# Altium project balancing_robot_board.PrjPCB
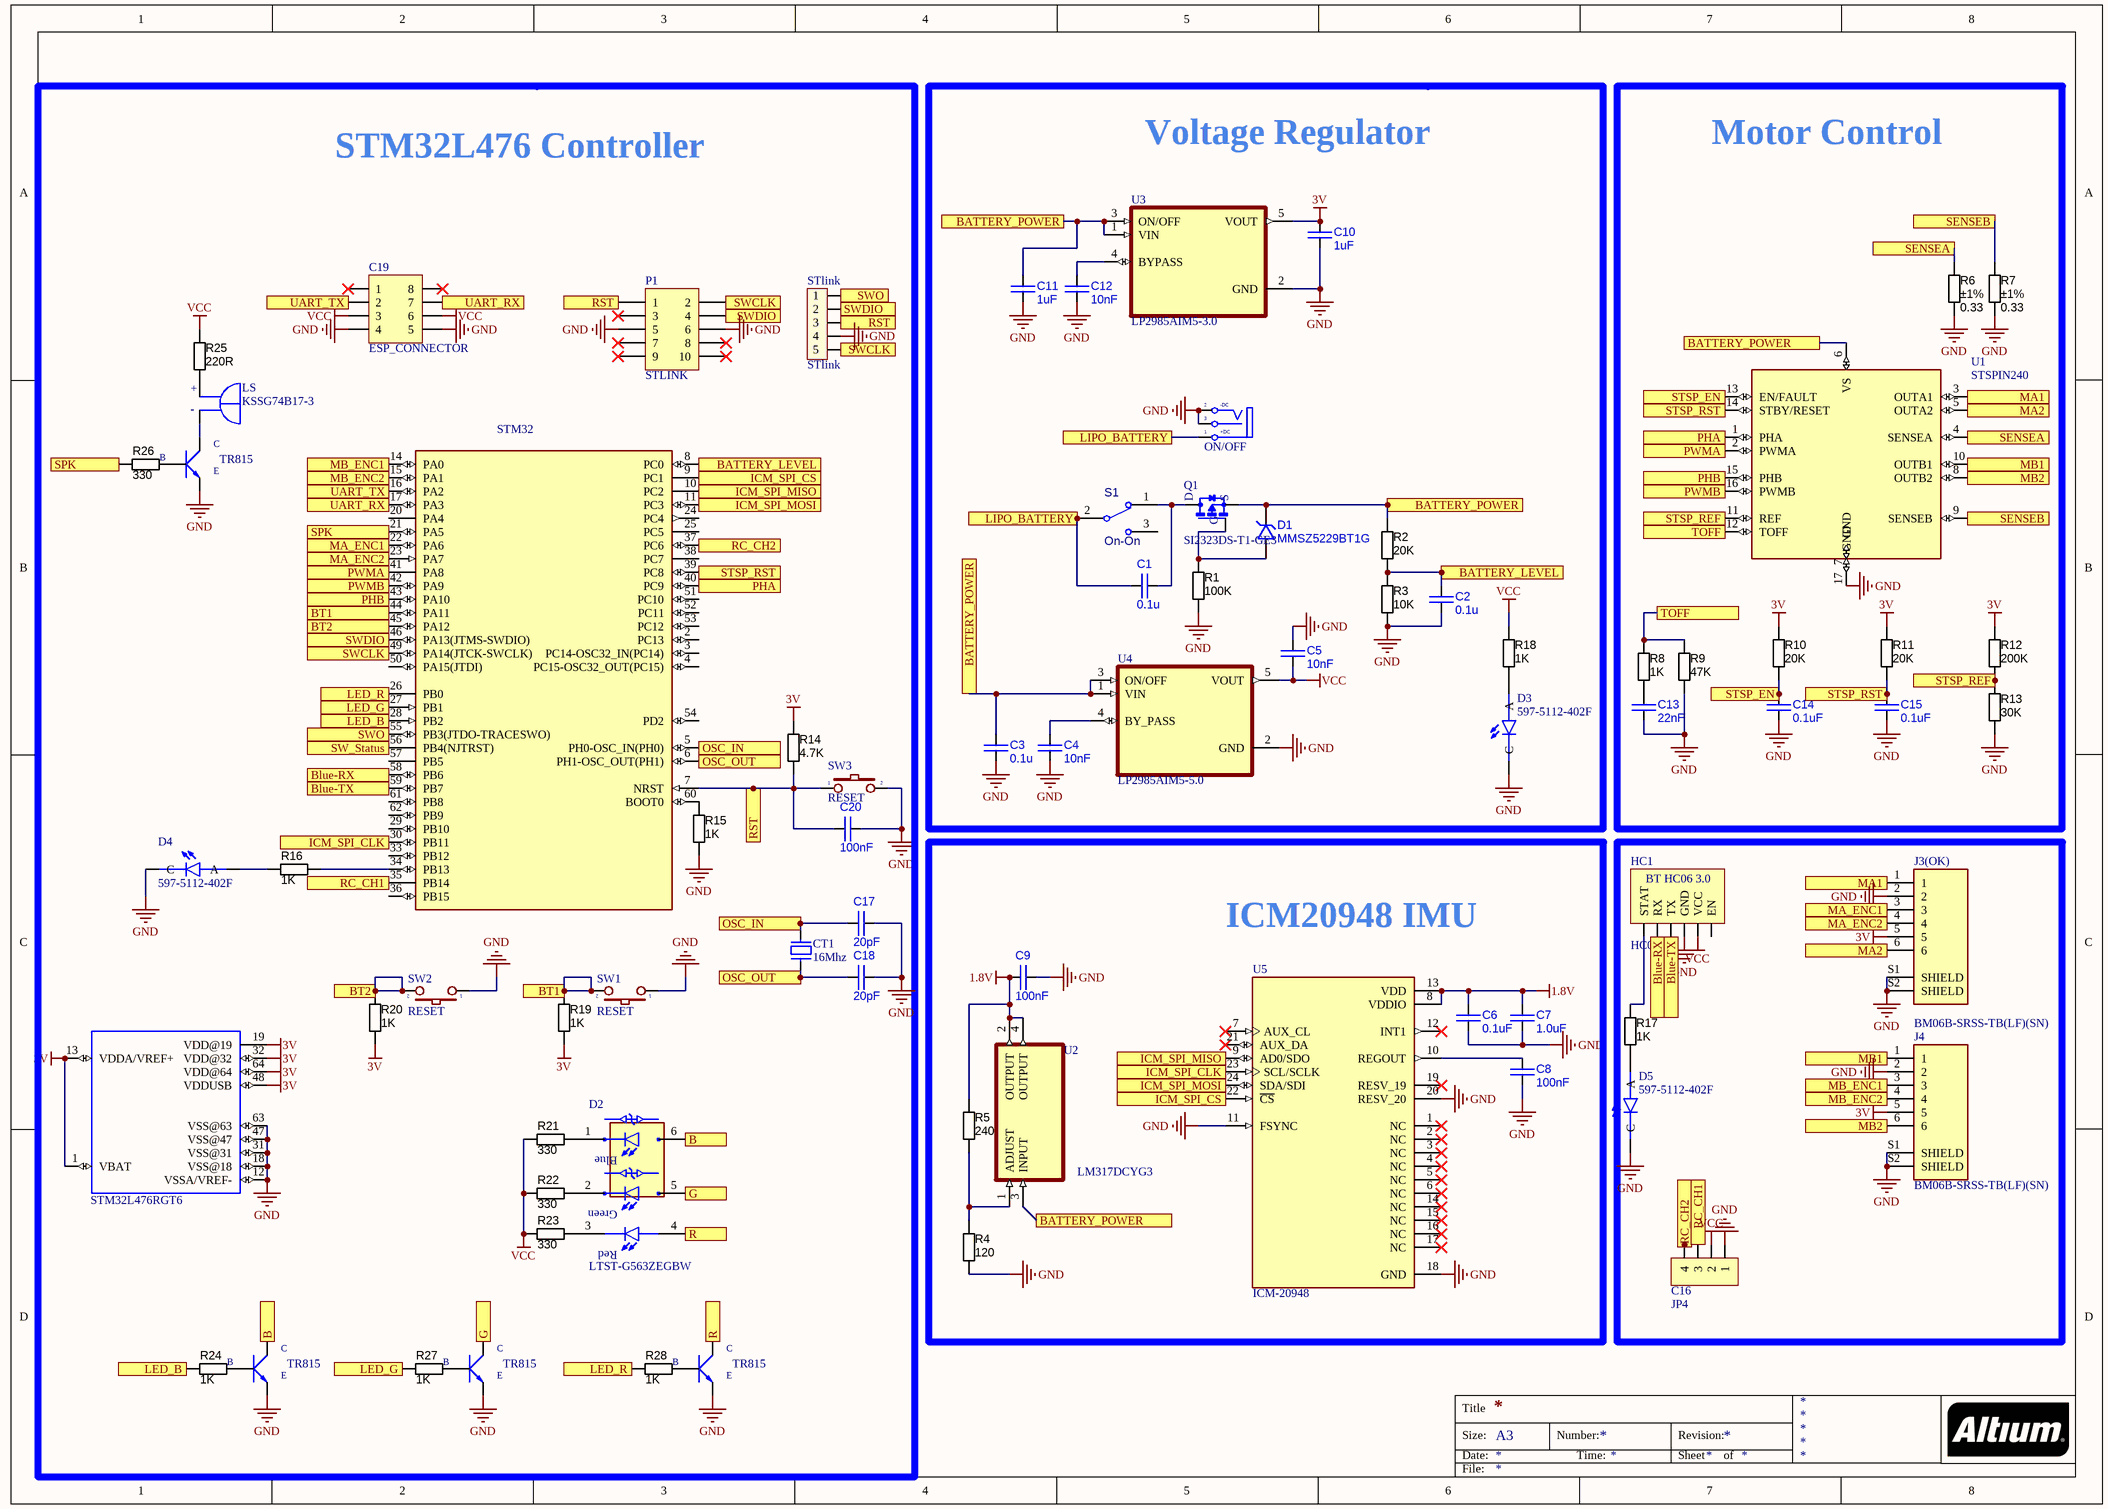
[diagram p0: balancing_robot_board.SchDoc]
1 sheet, 76 parts. Net scope: flat (ports and power ports of the same name join across sheets).
Board file: balancing_robot_board.PcbDoc

## Sheet balancing_robot_board.SchDoc
size A3

### Parts
C1  0.1u  [CAPC1005X55N]
C2  0.1u  [CAPC1005X55N]
C3  0.1u  [CAPC1005X55N]
C4  10nF  [CAPC1005X55N]
C5  10nF  [CAPC1005X55N]
C6  0.1uF  [CAPC1005X55N]
C7  1.0uF  [CAPC1005X55N]
C8  100nF  [CAPC1005X55N]
C9  100nF  [CAPC1005X55N]
C10  1uF  [CAPC1005X55N]
C11  1uF  [CAPC1005X55N]
C12  10nF  [CAPC1005X55N]
C13  22nF  [CAPC1005X55N]
C14  0.1uF  [CAPC1005X55N]
C15  0.1uF  [CAPC1005X55N]
C16  JP4  [JP4-C1T]
C17  20pF  [CAPC1005X55N]
C18  20pF  [CAPC1005X55N]
C19  ESP_CONNECTOR  [JP4-C2T]
C20  100nF  [CAPC1005X55N]
CT1  16Mhz  [CRYSTAL-SMD5032]
D1  MMSZ5229BT1G  [SOD123]
D2  LTST-G563ZEGBW  [LED_LTST-G563ZEGBW]
D3  597-5112-402F  [LEDSC160X80X70L45N]
D4  597-5112-402F  [LEDSC160X80X70L45N]
D5  597-5112-402F  [LEDSC160X80X70L45N]
HC1  HC06  [HC06]
J3(OK)  BM06B-SRSS-TB(LF)(SN)  [JST_BM06B-SRSS-TB(LF)(SN)]
J4  BM06B-SRSS-TB(LF)(SN)  [JST_BM06B-SRSS-TB(LF)(SN)]
LS  KSSG74B17-3  [XDCR_KSSG74B17-3]
ON/OFF  POWER  [PJ-031D]  (value not drawn)
P1  STLINK  [CABLE 10]
Q1  SI2323DS-T1-GE3  [SOT23]
R1  value 100K  [RESC1005X40N]  (hidden comment: Thick Film)
R2  value 20K  [RESC1005X40N]  (hidden comment: Thick Film)
R3  value 10K  [RESC1005X40N]  (hidden comment: Thick Film)
R4  value 120  [RESC1005X40N]  (hidden comment: Thick Film)
R5  value 240  [RESC1005X40N]  (hidden comment: Thick Film)
R6  value 0.33  Tolerance: ±1%  [RESC5025X70N]  (hidden comment: Thick Film)
R7  value 0.33  Tolerance: ±1%  [RESC5025X70N]  (hidden comment: Thick Film)
R8  value 1K  [RESC1005X40N]  (hidden comment: Thick Film)
R9  value 47K  [RESC1005X40N]  (hidden comment: Thick Film)
R10  value 20K  [RESC1005X40N]  (hidden comment: Thick Film)
R11  value 20K  [RESC1005X40N]  (hidden comment: Thick Film)
R12  value 200K  [RESC1005X40N]  (hidden comment: Thick Film)
R13  value 30K  [RESC1005X40N]  (hidden comment: Thick Film)
R14  value 4.7K  [RESC1005X40N]  (hidden comment: Thick Film)
R15  value 1K  [RESC1005X40N]  (hidden comment: Thick Film)
R16  value 1K  [RESC1005X40N]  (hidden comment: Thick Film)
R17  value 1K  [RESC1005X40N]  (hidden comment: Thick Film)
R18  value 1K  [RESC1005X40N]  (hidden comment: Thick Film)
R19  value 1K  [RESC1005X40N]  (hidden comment: Thick Film)
R20  value 1K  [RESC1005X40N]  (hidden comment: Thick Film)
R21  value 330  [RESC1005X40N]  (hidden comment: Thick Film)
R22  value 330  [RESC1005X40N]  (hidden comment: Thick Film)
R23  value 330  [RESC1005X40N]  (hidden comment: Thick Film)
R24  value 1K  [RESC1005X40N]  (hidden comment: Thick Film)
R25  value 220R  [RESC2012N_ZERO]  (hidden comment: Jumper)
R26  value 330  [RESC1005X40N]  (hidden comment: Thick Film)
R27  value 1K  [RESC1005X40N]  (hidden comment: Thick Film)
R28  value 1K  [RESC1005X40N]  (hidden comment: Thick Film)
S1  ON-ON  [Switch]
STA.TR1  TR815  [SOT-23B_L]
STA.TR2  TR815  [SOT-23B_L]
STA.TR3  TR815  [SOT-23B_L]
STA.TR4  TR815  [SOT-23B_L]
STlink  STlink  [JP5]
STM32  STM32L476RGT6  [LQFP-64(10X10)MM]
SW1  RESET  [SW1-SMD]
SW2  RESET  [SW1-SMD]
SW3  RESET  [SW1-SMD]
U1  STSPIN240  [VFQFPN_3X3X1MM]
U2  LM317DCYG3  [SOT230P700X180-4N]
U3  LP2985AIM5-3.0  [SOT95P280X145-5N]
U4  LP2985AIM5-5.0  [SOT95P280X145-5N]
U5  ICM-20948  [QFN40P300X300X105-24N]

### Blocks framed on the sheet
STM32L476 Controller: C17-C20 CT1 D2 D4 LS P1 R14-R16 R19-R28 STA.TR1-STA.TR4 STlink STM32 SW1-SW3
Voltage Regulator: C1-C5 C10-C12 D1 D3 ON/OFF Q1 R1-R3 R18 S1 U3 U4
Motor Control: C13-C15 R6-R13 U1
ICM20948 IMU: C6-C9 R4 R5 U2 U5

### Ports
B, BATTERY_LEVEL, BATTERY_POWER, Blue-RX, Blue-TX, BT1, BT2, G, ICM_SPI_CLK, ICM_SPI_CS, ICM_SPI_MISO, ICM_SPI_MOSI, LED_B, LED_G, LED_R, LIPO_BATTERY, MA1, MA2, MA_ENC1, MA_ENC2, MB1, MB2, MB_ENC1, MB_ENC2, OSC_IN, OSC_OUT, PHA, PHB, PWMA, PWMB, R, RC_CH1, RC_CH2, RST, SENSEA, SENSEB, SPK, STSP_EN, STSP_REF, STSP_RST, SW_Status, SWCLK, SWDIO, SWO, TOFF, UART_RX, UART_TX

### Nets
1.8V: C6.1 C7.1 C9.1 R5.1 U2.2(OUTPUT) U2.4(OUTPUT) U5.8(VDDIO) U5.13(VDD)
3V: C10.2 J3(OK).5 J4.5 R10.2 R11.2 R12.2 R14.1 R19.1 R20.1 STM32.1(VBAT) STM32.13(VDDA/VREF+) STM32.19(VDD@19) STM32.32(VDD@32) STM32.48(VDDUSB) STM32.64(VDD@64) U3.5(VOUT)
GND: C2.1 C3.2 C4.2 C5.1 C6.2 C7.2 C8.2 C9.2 C10.1 C11.1 C12.1 C13.1 C14.1 C15.1 C16.1 C17.2 C18.2 C19.4 C19.5 C20.1 D3.C D4.C D5.C HC1.4(GND) J3(OK).2 J3(OK).S1(SHIELD) J3(OK).S2(SHIELD) J4.2 J4.S1(SHIELD) J4.S2(SHIELD) ON/OFF.2(TN) ON/OFF.3(S) P1.5 P1.6 R1.1 R3.1 R4.2 R6.2 R7.2 R9.1 R13.1 R15.2 STA.TR1.1(E) STA.TR2.1(E) STA.TR3.1(E) STA.TR4.1(E) STlink.4 STM32.12(VSSA/VREF-) STM32.18(VSS@18) STM32.31(VSS@31) STM32.47(VSS@47) STM32.63(VSS@63) SW1.1 SW2.1 SW3.2 U1.17(GND) U3.2(GND) U4.2(GND) U5.11(FSYNC) U5.18(GND) U5.20(RESV_20)
VCC: C5.2 C16.2 C19.3 C19.6 HC1.5(VCC) R18.1 R21.1 R22.1 R23.1 R25.1 U4.5(VOUT)
NetC1_1: C1.1 ON/OFF.1(T) S1.2 ; port LIPO_BATTERY
NetC1_2: C1.2 Q1.3(D) S1.1
NetC2_2: C2.2 R2.1 R3.2 STM32.8(PC0) ; port BATTERY_LEVEL
NetC3_1: C3.1 C11.2 D1.K Q1.2(S) R2.2 U1.6(VS) U2.3(INPUT) U3.1(VIN) U3.3(ON/OFF) U4.1(VIN) U4.3(ON/OFF) ; port BATTERY_POWER
NetC4_1: C4.1 U4.4(BY_PASS)
NetC8_1: C8.1 U5.10(REGOUT)
NetC12_2: C12.2 U3.4(BYPASS)
NetC13_2: C13.2 R8.1
NetC14_2: C14.2 R10.1 U1.13(EN/FAULT) ; port STSP_EN
NetC15_2: C15.2 R11.1 STM32.39(PC8) U1.14(STBY/RESET) ; port STSP_RST
NetC16_3: C16.3 STM32.35(PB14) ; port RC_CH1
NetC17_1: C17.1 CT1.2 STM32.5(PH0-OSC_IN(PH0)) ; port OSC_IN
NetC18_1: C18.1 CT1.1 STM32.6(PH1-OSC_OUT(PH1)) ; port OSC_OUT
NetC19_2: C19.2 STM32.16(PA2) ; port UART_TX
NetC19_7: C19.7 STM32.17(PA3) ; port UART_RX
NetC20_2: C20.2 P1.1 R14.2 STlink.3 STM32.7(NRST) SW3.1 ; port RST
NetD1_A: D1.A Q1.1(G) R1.2
NetD2_1: D2.1 R21.2
NetD2_2: D2.2 R22.2
NetD2_3: D2.3 R23.2
NetD2_4: D2.4 STA.TR4.2(C) ; port R
NetD2_5: D2.5 STA.TR2.2(C) ; port G
NetD2_6: D2.6 STA.TR1.2(C) ; port B
NetD3_A: D3.A R18.2
NetD4_A: D4.A R16.2
NetD5_A: D5.A R17.2
NetHC1_1: HC1.1(STAT) R17.1
NetHC1_2: HC1.2(RX) STM32.58(PB6) ; port Blue-RX
NetHC1_3: HC1.3(TX) STM32.59(PB7) ; port Blue-TX
NetJ3(OK)_1: J3(OK).1 U1.3(OUTA1) ; port MA1
NetJ3(OK)_3: J3(OK).3 STM32.22(PA6) ; port MA_ENC1
NetJ3(OK)_4: J3(OK).4 STM32.23(PA7) ; port MA_ENC2
NetJ3(OK)_6: J3(OK).6 U1.5(OUTA2) ; port MA2
NetJ4_1: J4.1 U1.10(OUTB1) ; port MB1
NetJ4_3: J4.3 STM32.14(PA0) ; port MB_ENC1
NetJ4_4: J4.4 STM32.15(PA1) ; port MB_ENC2
NetJ4_6: J4.6 U1.8(OUTB2) ; port MB2
NetLS_N: LS.N(NEG) STA.TR3.2(C)
NetLS_P: LS.P(POS) R25.2
NetP1_2: P1.2 STlink.5 STM32.49(PA14(JTCK-SWCLK)) ; port SWCLK
NetP1_4: P1.4 STlink.2 STM32.46(PA13(JTMS-SWDIO)) ; port SWDIO
NetR4_1: R4.1 R5.2 U2.1(ADJUST)
NetR6_1: R6.1 U1.4(SENSEA) ; port SENSEA
NetR7_1: R7.1 U1.9(SENSEB) ; port SENSEB
NetR8_2: R8.2 R9.2 U1.12(TOFF) ; port TOFF
NetR12_1: R12.1 R13.2 U1.11(REF) ; port STSP_REF
NetR15_1: R15.1 STM32.60(BOOT0)
NetR16_1: R16.1 STM32.34(PB13)
NetR19_2: R19.2 STM32.44(PA11) SW1.2 ; port BT1
NetR20_2: R20.2 STM32.45(PA12) SW2.2 ; port BT2
NetR24_1: R24.1 STA.TR1.3(B)
NetR24_2: R24.2 STM32.28(PB2) ; port LED_B
NetR26_1: R26.1 STA.TR3.3(B)
NetR26_2: R26.2 STM32.21(PA5) ; port SPK
NetR27_1: R27.1 STA.TR2.3(B)
NetR27_2: R27.2 STM32.27(PB1) ; port LED_G
NetR28_1: R28.1 STA.TR4.3(B)
NetR28_2: R28.2 STM32.26(PB0) ; port LED_R
NetSTlink_1: STlink.1 STM32.55(PB3(JTDO-TRACESWO)) ; port SWO
NetSTM32_9: STM32.9(PC1) U5.22(~{CS}) ; port ICM_SPI_CS
NetSTM32_10: STM32.10(PC2) U5.9(AD0/SDO) ; port ICM_SPI_MISO
NetSTM32_11: STM32.11(PC3) U5.24(SDA/SDI) ; port ICM_SPI_MOSI
NetSTM32_30: STM32.30(PB11) U5.23(SCL/SCLK) ; port ICM_SPI_CLK
NetSTM32_37: STM32.37(PC6) ; port RC_CH2
NetSTM32_40: STM32.40(PC9) U1.1(PHA) ; port PHA
NetSTM32_41: STM32.41(PA8) U1.2(PWMA) ; port PWMA
NetSTM32_42: STM32.42(PA9) U1.16(PWMB) ; port PWMB
NetSTM32_43: STM32.43(PA10) U1.15(PHB) ; port PHB
NetSTM32_56: STM32.56(PB4(NJTRST)) ; port SW_Status

Not connected (* = marked no-connect by the designer): C16 4; C19 1* 8*; HC1 6(EN); P1 3* 7* 8* 9* 10*; S1 3; STM32 2(PC13) 3(PC14-OSC32_IN(PC14)) 4(PC15-OSC32_OUT(PC15)) 20(PA4) 24(PC4) 25(PC5) 29(PB10) 33(PB12) 36(PB15) 38(PC7) 50(PA15(JTDI)) 51(PC10) 52(PC11) 53(PC12) 54(PD2) 57(PB5) 61(PB8) 62(PB9); U1 7(GND); U5 1(NC)* 2(NC)* 3(NC)* 4(NC)* 5(NC)* 6(NC)* 7(AUX_CL)* 12(INT1)* 14(NC)* 15(NC)* 16(NC)* 17(NC)* 19(RESV_19)* 21(AUX_DA)*

### Notes on the sheet
- Title
- Size:
- Date:
- A3
- Number:
- Time:
- Revision:
- Sheet
- of
- File:
- (in symbol DCIN) -DC; +DC
- (in symbol HC06) BT HC06 3.0
- (in symbol KSSG74B17-3) +; -
- (in symbol LTST-G563ZEGBW) Blue; Green; Red

### Library data of the parts
C1-C15 C17 C18 C20 = CAP C_0402: Capacitor SMD Cer 1nF 10% 16V X7R 0402; Manufacturer 1: AVX Corporation; Manufacturer Part Number 1: 0402YC102KAT2A; Ratings: 16V; X7R; SCDType: spec; Tolerance: ±10%; Operating Temperature: -55°C ~ 125°C; Package / Case: 0402 (1005 Metric); Size / Dimension: 0.039" L x 0.020" W (1.00mm x 0.50mm); Manufacturer 2: Yageo; Manufacturer Part Number 2: CC0402KRX7R7BB102; Supplier 1: Digi-Key; Supplier Part Number 1: 478-6197-1-ND; ComponentLink1URL: http://www.avx.com/docs/Catalogs/cx7r.pdf; ComponentLink1Description: http://www.avx.com/docs/Catalogs/cx7r.pdf; Supplier 2: Digi-Key; Supplier Part Number 2: 311-1352-1-ND; ComponentLink2URL: http://www.yageo.com/documents/recent/UPY-GPHC_X7R_6.3V-to-50V_8.pdf; ComponentLink2Description: http://www.yageo.com/documents/recent/UPY-GPHC_X7R_6.3V-to-50V_8.pdf
  C1-C3: Value: 0.1u
  C4 C5 C12: Value: 10nF
  C6 C14 C15: Value: 0.1uF
  C7: Value: 1.0uF
  C8 C9 C20: Value: 100nF
  C10 C11: Value: 1uF
  C13: Value: 22nF
  C17 C18: Value: 20pF
C16 = JP4: WR-PHD 2.54 mm Angled Socket Header; Manufacturer: W¨¹rth Elektronik eiSos GmbH; partNo: 613004143121; ComponentLink1 Description: Manufacturer; ComponentLink2 Description: Datasheet; NoPins: 04; Created Date: 29 March 2013; ComponentLink1URL: http://www.we-online.com; ComponentLink2URL: http://katalog.we-online.de/em/datasheet/6130xx143121.pdf; Created by: Karrer Zheng
C19 = JP4x2: WR-PHD 2.54 mm Dual Socket Header; Manufacturer: W¨¹rth Elektronik eiSos GmbH; partNo: 61300821821; ComponentLink1 Description: Manufacturer; ComponentLink2 Description: Datasheet; NoPins: 08; Created Date: 29 March 2013; ComponentLink1URL: http://www.we-online.com; ComponentLink2URL: http://katalog.we-online.de/em/datasheet/6130xx21821.pdf; Created by: Karrer Zheng
CT1 = CRYSTAL: Crystal For all Crystal 2pin.; Value: 4Mhz
D1 = DIODE_ZENER_4.7V_500mW: Diode Zener SMD 4.7V 0.5W SOD-123; Manufacturer 1: Fairchild Semiconductor; Manufacturer Part Number 1: MMSZ4688; Ratings: 4.7V; 0.5W; Vf=900mV @ 10mA; Material: Si; Tolerance: ±5%; SCDType: source; Package / Case: SOD-123; Diode Type: Zener; Supplier 1: Digi-Key; Supplier Part Number 1: MMSZ4688-ND
D2 = LTST-G563ZEGBW: LED; SMD; 5050, PLCC6; RGB; 5x5x1.6mm; 120Â°; 20mA; Lens: transparent; MF: Lite-On; Check_prices: https://www.snapeda.com/parts/LTST-G563ZEGBW/Lite-On/view-part/?ref=eda; Price: None; MP: LTST-G563ZEGBW; SnapEDA_Link: https://www.snapeda.com/parts/LTST-G563ZEGBW/Lite-On/view-part/?ref=snap; Availability: Not in stock; Value: *; Package: PLCC-6 Lite-On
D3-D5 = 597-5112-402F: SMD LED 0603 R SAMPLE STRIP; Discretes | Dialight 597-5112-402F; SnapEDA_Link: https://www.snapeda.com/parts/597-5112-402F/Dialight/view-part/?ref=snap; Package: 0603 Dialight; Value: *; MF: Dialight; MP: 597-5112-402F; Check_prices: https://www.snapeda.com/parts/597-5112-402F/Dialight/view-part/?ref=eda
HC1 = HC06: Manufacturer: W¨¹rth Elektronik eiSos GmbH; partNo: 613004143121; ComponentLink1 Description: Manufacturer; ComponentLink2 Description: Datasheet; NoPins: 04; Created Date: 29 March 2013; ComponentLink1URL: http://www.we-online.com; ComponentLink2URL: http://katalog.we-online.de/em/datasheet/6130xx143121.pdf; Created by: Karrer Zheng
ON/OFF = DCIN
P1 = CABLE 10: Header, 5-Pin, Dual row; LatestRevisionDate: 17-Jul-2002; LatestRevisionNote: Re-released for DXP Platform.; Publisher: Altium Limited
Q1 = SI2323DS-T1-GE3: 20V 4.7A 1.25W 39 mohms @ 4.5V | Siliconix / Vishay SI2323DS-T1-GE3; MF: Vishay Siliconix; SnapEDA_Link: https://www.snapeda.com/parts/SI2323DS-T1-GE3/Vishay/view-part/?ref=snap; Package: SOT-23-3 Vishay Siliconix; Value: *; MP: SI2323DS-T1-GE3; Check_prices: https://www.snapeda.com/parts/SI2323DS-T1-GE3/Vishay/view-part/?ref=eda
R1-R5 R8-R24 R26-R28 = RES_0402: Resistor SMD chip 1k Ohm 0.063W 5% 0402; Manufacturer 1: Yageo; Manufacturer Part Number 1: RC0402JR-071KL; Ratings: 1/16 W; SCDType: spec; Package / Case: 0402 (1005 Metric); Tolerance: ±5%; Supplier 1: Digi-Key; Supplier Part Number 1: 311-1.0KJRCT-ND; RoHS 1: RoHS Compliant; ComponentLink1URL: http://www.yageo.com/documents/recent/PYu-RC0402_51_RoHS_L_6.pdf; ComponentLink1Description: http://www.yageo.com/documents/recent/PYu-RC0402_51_RoHS_L_6.pdf; Supplier 2: Digi-Key; Supplier Part Number 2: 541-1.0KJCT-ND; Manufacturer 2: Vishay Dale; Manufacturer Part Number 2: CRCW04021K00JNED; RoHS 2: RoHS Compliant; ComponentLink2URL: http://www.vishay.com/doc?20035; ComponentLink2Description: http://www.vishay.com/doc?20035; Supplier 3: Digi-Key; Supplier Part Number 3: 1276-4376-1-ND; Manufacturer 3: Samsung Electro-Mechanics America, Inc; Manufacturer Part Number 3: RC1005J102CS; RoHS 3: RoHS Compliant; ComponentLink3URL: http://www.samsungsem.com/servlet/FileDownload?filename=productcatalog/pdf/Chip_Resistor.pdf; ComponentLink3Description: http://www.samsungsem.com/servlet/FileDownload?filename=productcatalog/pdf/Chip_Resistor.pdf; Supplier 4: Digi-Key; Supplier Part Number 4: RHM1.0KCECT-ND; Manufacturer 4: Rohm Semiconductor; Manufacturer Part Number 4: MCR01MRTJ102; RoHS 4: RoHS Compliant; ComponentLink4URL: http://rohmfs.rohm.com/en/products/databook/datasheet/passive/resistor/chip_resistor/mcr_g.pdf; ComponentLink4Description: http://rohmfs.rohm.com/en/products/databook/datasheet/passive/resistor/chip_resistor/mcr_g.pdf; Supplier 5: Digi-Key; Supplier Part Number 5: P1.0KJCT-ND; Manufacturer 5: Panasonic Electronic Components; Manufacturer Part Number 5: ERJ-2GEJ102X; RoHS 5: RoHS Compliant; ComponentLink5URL: http://industrial.panasonic.com/www-cgi/jvcr13pz.cgi?E+PZ+3+AOA0001+ERJ2GEJ102X+7+WW; ComponentLink5Description: http://industrial.panasonic.com/www-cgi/jvcr13pz.cgi?E+PZ+3+AOA0001+ERJ2GEJ102X+7+WW
R6 = RES_2010: Resistor SMD chip 10 Ohm 0.25W 1% 2010; Manufacturer 1: Vishay/Dale; Manufacturer Part Number 1: CRCW120610R0JNEA; Ratings: 1/4W; SCDType: undef; Package / Case: 2010; Supplier 1: Digi-Key; Supplier Part Number 1: 541-10ECT-ND; ComponentLink1URL: http://www.vishay.com/doc?20035; ComponentLink1Description: http://www.vishay.com/doc?20035
R7 = RES_2010: Resistor SMD chip 10 Ohm 0.25W 5% 2010; Manufacturer 1: Vishay/Dale; Manufacturer Part Number 1: CRCW120610R0JNEA; Ratings: 1/4W; SCDType: undef; Package / Case: 2010; Supplier 1: Digi-Key; Supplier Part Number 1: 541-10ECT-ND; ComponentLink1URL: http://www.vishay.com/doc?20035; ComponentLink1Description: http://www.vishay.com/doc?20035
R25 = RES_0805: Resistor SMD chip 0.0 Ohm 0.125W 0805; Manufacturer 1: Samsung Electro-Mechanics America, Inc; Manufacturer Part Number 1: RC2012J000CS; Ratings: 1/8W; SCDType: spec; Tolerance: N/A; Package / Case: 0805 (2012 metric); Supplier 1: Digi-Key; Supplier Part Number 1: 1276-5466-6-ND; RoHS 1: RoHS Compliant; ComponentLink1URL: http://www.samsungsem.com/servlet/FileDownload?filename=productcatalog/pdf/Chip_Resistor.pdf; ComponentLink1Description: http://www.samsungsem.com/servlet/FileDownload?filename=productcatalog/pdf/Chip_Resistor.pdf; Supplier 2: Digi-Key; Supplier Part Number 2: RMCF0805ZT0R00DKR-ND; Manufacturer 2: Stackpole Electronics Inc; Manufacturer Part Number 2: RMCF0805ZT0R00; RoHS 2: RoHS Compliant; ComponentLink2URL: http://www.seielect.com/Catalog/SEI-RMCF_RMCP.pdf; ComponentLink2Description: http://www.seielect.com/Catalog/SEI-RMCF_RMCP.pdf; Supplier 3: Digi-Key; Supplier Part Number 3: 311-0.0ARDKR-ND; Manufacturer 3: Yageo; Manufacturer Part Number 3: RC0805JR-070RL; RoHS 3: RoHS Compliant; ComponentLink3URL: http://media.digikey.com/pdf/Data%20Sheets/Yageo%20PDFs/RC0805%20Pb%20Free.pdf; ComponentLink3Description: http://media.digikey.com/pdf/Data%20Sheets/Yageo%20PDFs/RC0805%20Pb%20Free.pdf; Supplier 4: Digi-Key; Supplier Part Number 4: P0.0ADKR-ND; Manufacturer 4: Panasonic Electronic Components; Manufacturer Part Number 4: ERJ-6GEY0R00V; RoHS 4: RoHS Compliant; ComponentLink4URL: http://industrial.panasonic.com/www-cgi/jvcr13pz.cgi?E+PZ+3+AOA0001+ERJ6GEY0R00V+7+WW; ComponentLink4Description: http://industrial.panasonic.com/www-cgi/jvcr13pz.cgi?E+PZ+3+AOA0001+ERJ6GEY0R00V+7+WW; Supplier 5: Digi-Key; Supplier Part Number 5: RHM0.0CPDKR-ND; Manufacturer 5: Rohm Semiconductor; Manufacturer Part Number 5: MCR10ERTJ000; RoHS 5: RoHS Compliant; ComponentLink5URL: http://rohmfs.rohm.com/en/products/databook/datasheet/passive/resistor/chip_resistor/mcr_g.pdf; ComponentLink5Description: http://rohmfs.rohm.com/en/products/databook/datasheet/passive/resistor/chip_resistor/mcr_g.pdf
S1 = SW_THD_SPDT_On-On: Switch THD vertical toggle SPDT; Manufacturer 1: TE Connectivity; Manufacturer Part Number 1: SLS121PC04; Contact Rating @ Voltage: 0.25A @ 125VAC; SCDType: spec; Circuit: SPDT; Mounting Type: PCB mount; Supplier 1: Digi-Key; Supplier Part Number 1: 450-1598-ND; Switch Function: On-On
STA.TR1-STA.TR4 = C1815: NPN 600mW, ECB; Value: C1815
STlink = JP5
STM32 = STM32L476RGT6: ARMÂ® CortexÂ®-M4 STM32L4 Microcontroller IC 32-Bit Single-Core 80MHz 1MB (1M x 8) FLASH 64-LQFP (10x10); MF: STMicroelectronics; SnapEDA_Link: https://www.snapeda.com/parts/STM32L476RGT6/STMicroelectronics/view-part/?ref=snap; Package: LQFP-64 STMicroelectronics; Value: *; MP: STM32L476RGT6; Check_prices: https://www.snapeda.com/parts/STM32L476RGT6/STMicroelectronics/view-part/?ref=eda
SW1-SW3 = SW2: Switch button 2 pin; Value: SW chip 2 pin
U1 = STSPIN240: Half Bridge (4) Driver DC Motors, General Purpose Power MOSFET 16-VFQFPN (3x3); MF: STMicroelectronics; SnapEDA_Link: https://www.snapeda.com/parts/STSPIN240/STMicroelectronics/view-part/?ref=snap; Package: VFQFN-16 STMicroelectronics; Value: *; MP: STSPIN240; Check_prices: https://www.snapeda.com/parts/STSPIN240/STMicroelectronics/view-part/?ref=eda
U2 = LM317DCYG3: 1.5-A, 40-V, adjustable linear voltage regulator 4-SOT-223 0 to 125; MF: Texas Instruments; SnapEDA_Link: https://www.snapeda.com/parts/LM317DCYG3/Texas+Instruments/view-part/?ref=snap; Package: SOT-223-4 Texas Instruments; Value: *; MP: LM317DCYG3; Check_prices: https://www.snapeda.com/parts/LM317DCYG3/Texas+Instruments/view-part/?ref=eda
U3 = LP2985AIM5-3.0: 150-mA, 16-V, low-dropout voltage regulator with enable; MF: Texas Instruments; MP: LP2985AIM5-3.0/NOPB; SnapEDA_Link: https://www.snapeda.com/parts/LP2985AIM5-3.0/NOPB/Texas+Instruments/view-part/?ref=snap; Package: SOT-23-5 Texas Instruments; Value: *; Check_prices: https://www.snapeda.com/parts/LP2985AIM5-3.0/NOPB/Texas+Instruments/view-part/?ref=eda
U4 = LP2985AIM5-5.0: 150-mA, 16-V, low-dropout voltage regulator with enable; MF: Texas Instruments; MP: LP2985AIM5-5.0/NOPB; SnapEDA_Link: https://www.snapeda.com/parts/LP2985AIM5-5.0/NOPB/Texas+Instruments/view-part/?ref=snap; Package: SOT-23-5 Texas Instruments; Value: *; Check_prices: https://www.snapeda.com/parts/LP2985AIM5-5.0/NOPB/Texas+Instruments/view-part/?ref=eda
U5 = ICM-20948: Accelerometer, Gyroscope, Magnetometer, 9 Axis Sensor I2C, SPI Output; MF: TDK InvenSense; SnapEDA_Link: https://www.snapeda.com/parts/ICM-20948/TDK/view-part/?ref=snap; Package: TFQFN-24 TDK InvenSense; Value: *; MP: ICM-20948; Check_prices: https://www.snapeda.com/parts/ICM-20948/TDK/view-part/?ref=eda
J3(OK) J4 = BM06B-SRSS-TB(LF)(SN): Package: None; Price: None; Value: *; MP: BM06B-SRSS-TB(LF)(SN); Availability: Unavailable
LS = KSSG74B17-3: Availability: Unavailable; Price: None; Package: None; Value: *; MP: KSSG74B17-3